# Altium schematic sheet P03-DAC_OUTPUT.SchDoc
size A3; Date: 2015/11/20; CompanyName: 成都淞幸科技有限责任公司; DrawnBy: 冯光荣; Engineer: 冯光荣; Organization: 系统集成部; Address1: 四川省成都市西航港街道珠江路; Address2: 空港国际城7栋1单元11层; DocumentNumber: SX-ZNJJ-02; Revision: v3.1; SheetNumber: 4; SheetTotal: 6; Telphone: 028-6445 2893; Fax: 028-8580 5757; Website: www.sunsheen.cn; DocumentName: DocumentName; ProjectName: ProjectName
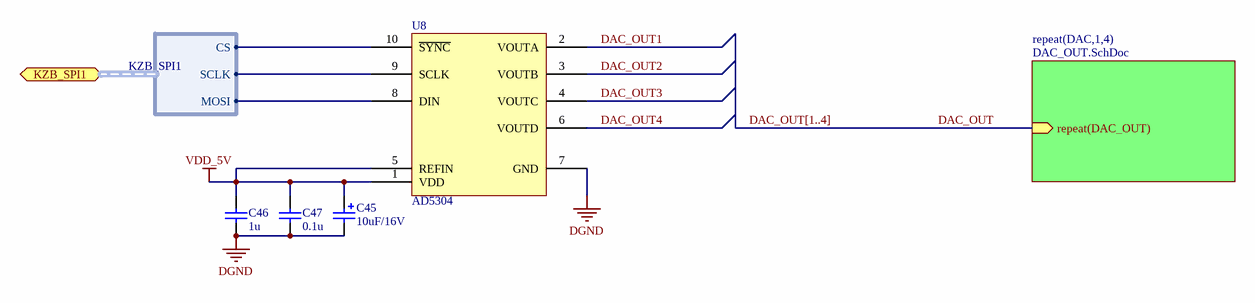
[diagram p0: P03-DAC_OUTPUT.SchDoc]

## Parts
C45  10uF/16V  [CAPPLO3_A_3216-18]
C46  1u  [Cap0603]
C47  0.1u  [Cap0603]
U8  AD5304  [MSOP10]

## Sub-sheets
repeat(DAC,1,4) = DAC_OUT.SchDoc: repeat(DAC_OUT) (in)

## Ports
KZB_SPI1 (harness KZB_SPI1)

## Harnesses
KZB_SPI1: CS, SCLK, MOSI

## Nets
DGND: C45.2 C46.1 C47.1 U8.7(GND)
VDD_5V: C45.1 C46.2 C47.2 U8.1(VDD) U8.5(REFIN)
DAC_OUT: sheet repeat(DAC,1,4)/repeat(DAC_OUT)
DAC_OUT1: U8.2(VOUTA)
DAC_OUT2: U8.3(VOUTB)
DAC_OUT3: U8.4(VOUTC)
DAC_OUT4: U8.6(VOUTD)
NetU8_8: U8.8(DIN) ; port KZB_SPI1.MOSI
NetU8_9: U8.9(SCLK) ; port KZB_SPI1.SCLK
NetU8_10: U8.10(~{SYNC}) ; port KZB_SPI1.CS

## Buses and harness runs
bus DAC_OUT[1..4]

## Notes on the sheet
- 签  名
- 底图总号
- 旧底图总号
- 媒体编号
- 日 期
- 批  准
- 审  核
- 校  对
- 设  计
- 标记
- 数量
- 文件编号：
- 更改单号
- 日  期
- 网址：
- 电话：
- 地址：
- 传真：
- 第
- 版  本
- 页
- 共
- A3
- 工程师

## Library data of the parts
C45 = Cap Pol3: 极性电容（表贴）
C46 C47 = Cap Semi: 无极性电容（表贴）